# Altium schematic sheet CRAM_Mk1_connectors.SchDoc
size A4; SheetNumber: 2; SheetTotal: 2
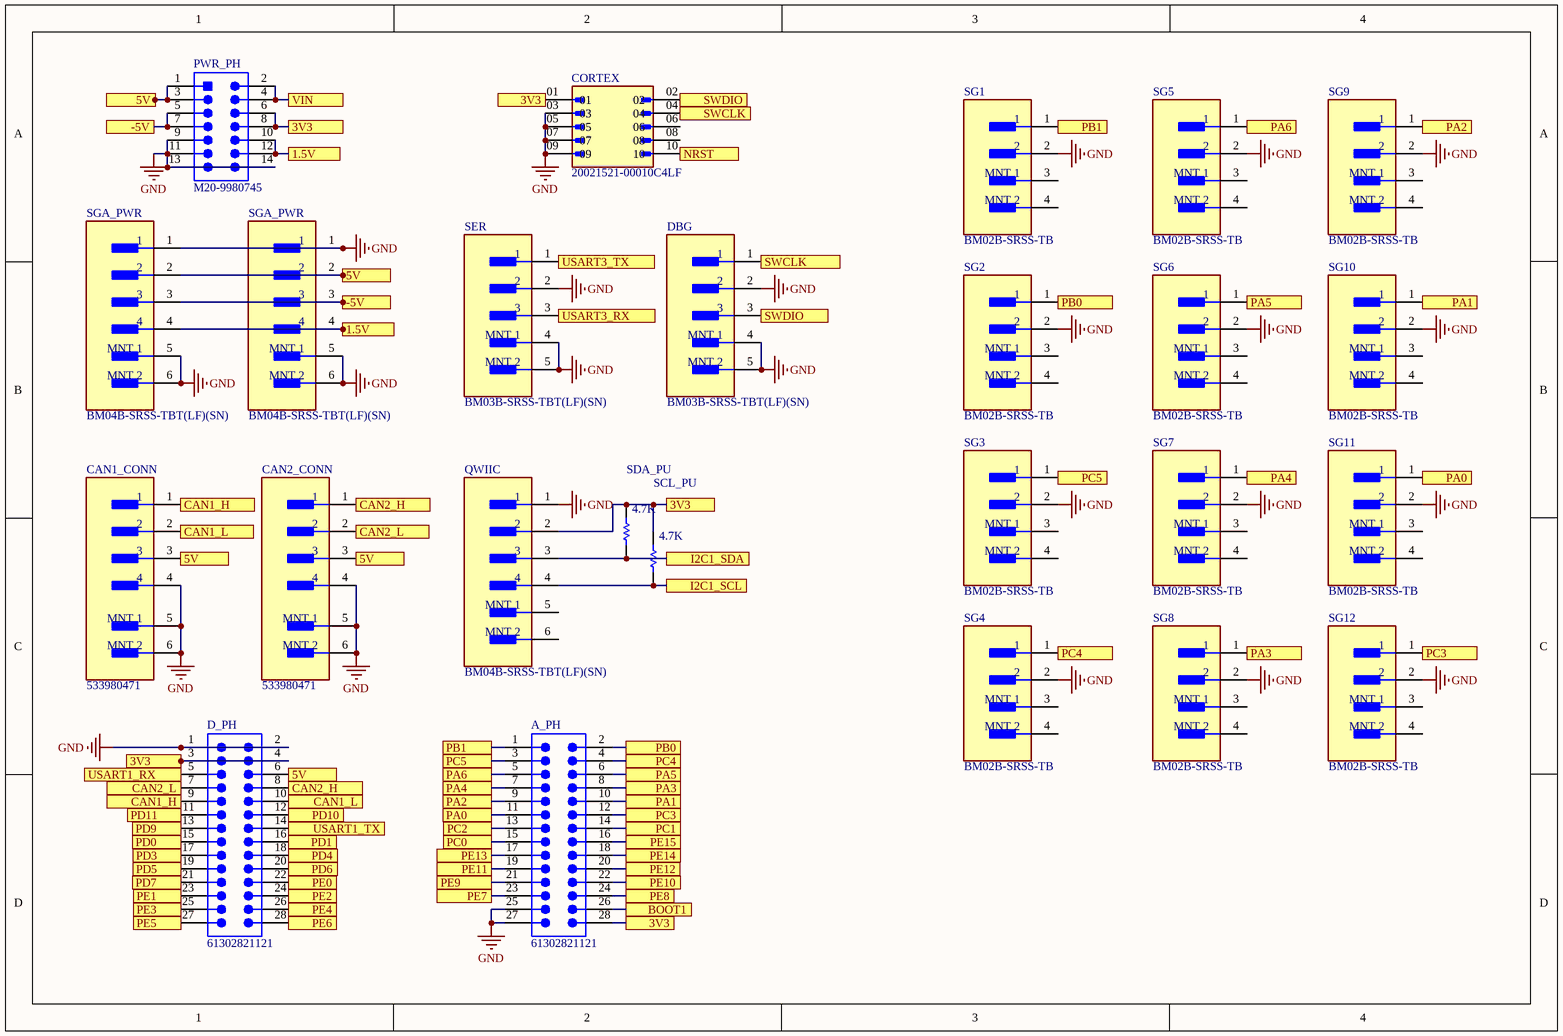
[diagram p0: CRAM_Mk1_connectors.SchDoc]

## Parts
(Parts that share a designator on the sheet are numbered #1, #2 ... from top to bottom, then left to right.)
A_PH  61302821121  [61302821121]
CAN1_CONN  533980471  [FP-533980471-MFG]
CAN2_CONN  533980471  [FP-533980471-MFG]
CORTEX  20021521-00010C4LF  [AMPHENOL_20021521-00010C4LF]
D_PH  61302821121  [61302821121]
DBG  BM03B-SRSS-TBT(LF)(SN)  [FP-BM03B-SRSS-TBT_LF_SN-MFG]
PWR_PH  M20-9980745  [HRWN-M20-9980745_V]
QWIIC  BM04B-SRSS-TBT(LF)(SN)  [FP-BM04B-SRSS-TBT_LF_SN-MFG]
SCL_PU  value 4.7K  [RESC1608X55X25ML10T15]  (hidden comment: Resistor 0R +/- 5% 0603 100 mW)
SDA_PU  value 4.7K  [RESC1608X55X25ML10T15]  (hidden comment: Resistor 0R +/- 5% 0603 100 mW)
SER  BM03B-SRSS-TBT(LF)(SN)  [FP-BM03B-SRSS-TBT_LF_SN-MFG]
SG1  BM02B-SRSS-TB  [FP-BM02B-SRSS-TB-MFG]
SG2  BM02B-SRSS-TB  [FP-BM02B-SRSS-TB-MFG]
SG3  BM02B-SRSS-TB  [FP-BM02B-SRSS-TB-MFG]
SG4  BM02B-SRSS-TB  [FP-BM02B-SRSS-TB-MFG]
SG5  BM02B-SRSS-TB  [FP-BM02B-SRSS-TB-MFG]
SG6  BM02B-SRSS-TB  [FP-BM02B-SRSS-TB-MFG]
SG7  BM02B-SRSS-TB  [FP-BM02B-SRSS-TB-MFG]
SG8  BM02B-SRSS-TB  [FP-BM02B-SRSS-TB-MFG]
SG9  BM02B-SRSS-TB  [FP-BM02B-SRSS-TB-MFG]
SG10  BM02B-SRSS-TB  [FP-BM02B-SRSS-TB-MFG]
SG11  BM02B-SRSS-TB  [FP-BM02B-SRSS-TB-MFG]
SG12  BM02B-SRSS-TB  [FP-BM02B-SRSS-TB-MFG]
SGA_PWR#1  BM04B-SRSS-TBT(LF)(SN)  [FP-BM04B-SRSS-TBT_LF_SN-MFG]
SGA_PWR#2  BM04B-SRSS-TBT(LF)(SN)  [FP-BM04B-SRSS-TBT_LF_SN-MFG]

## Ports
1.5V, 3V3, 5V, -5V, BOOT1, CAN1_H, CAN1_L, CAN2_H, CAN2_L, I2C1_SCL, I2C1_SDA, NRST, PA0, PA1, PA2, PA3, PA4, PA5, PA6, PB0, PB1, PC0, PC1, PC2, PC3, PC4, PC5, PD0, PD1, PD3, PD4, PD5, PD6, PD7, PD9, PD10, PD11, PE0, PE1, PE2, PE3, PE4, PE5, PE6, PE7, PE8, PE9, PE10, PE11, PE12, PE13, PE14, PE15, SWCLK, SWDIO, USART1_RX, USART1_TX, USART3_RX, USART3_TX, VIN

## Nets
GND: A_PH.25 A_PH.27 CAN1_CONN.4 CAN1_CONN.5(MNT_1) CAN1_CONN.6(MNT_2) CAN2_CONN.4 CAN2_CONN.5(MNT_1) CAN2_CONN.6(MNT_2) CORTEX.03 CORTEX.05 CORTEX.07 CORTEX.09 D_PH.1 D_PH.2 DBG.2 DBG.4(MNT_1) DBG.5(MNT_2) PWR_PH.9 PWR_PH.11 PWR_PH.13 PWR_PH.14 QWIIC.1 SER.2 SER.4(MNT_1) SER.5(MNT_2) SG1.2 SG2.2 SG3.2 SG4.2 SG5.2 SG6.2 SG7.2 SG8.2 SG9.2 SG10.2 SG11.2 SG12.2 SGA_PWR#1.1 SGA_PWR#1.5(MNT_1) SGA_PWR#1.6(MNT_2) SGA_PWR#2.1 SGA_PWR#2.5(MNT_1) SGA_PWR#2.6(MNT_2)
1.5V: PWR_PH.10 PWR_PH.12 SGA_PWR#1.4 SGA_PWR#2.4 ; port 1.5V
3V3: A_PH.28 CORTEX.01 D_PH.3 D_PH.4 PWR_PH.6 PWR_PH.8 QWIIC.2 SCL_PU.2 SDA_PU.2 ; port 3V3
5V: CAN1_CONN.3 CAN2_CONN.3 D_PH.6 PWR_PH.1 PWR_PH.3 SGA_PWR#1.2 SGA_PWR#2.2 ; port 5V
-5V: PWR_PH.5 PWR_PH.7 SGA_PWR#1.3 SGA_PWR#2.3 ; port -5V
BOOT1: A_PH.26 ; port BOOT1
CAN1_H: CAN1_CONN.1 D_PH.9 ; port CAN1_H
CAN1_L: CAN1_CONN.2 D_PH.10 ; port CAN1_L
CAN2_H: CAN2_CONN.1 D_PH.8 ; port CAN2_H
CAN2_L: CAN2_CONN.2 D_PH.7 ; port CAN2_L
I2C1_SCL: QWIIC.4 SCL_PU.1 ; port I2C1_SCL
I2C1_SDA: QWIIC.3 SDA_PU.1 ; port I2C1_SDA
NRST: CORTEX.10 ; port NRST
PA0: A_PH.11 SG11.1 ; port PA0
PA1: A_PH.10 SG10.1 ; port PA1
PA2: A_PH.9 SG9.1 ; port PA2
PA3: A_PH.8 SG8.1 ; port PA3
PA4: A_PH.7 SG7.1 ; port PA4
PA5: A_PH.6 SG6.1 ; port PA5
PA6: A_PH.5 SG5.1 ; port PA6
PB0: A_PH.2 SG2.1 ; port PB0
PB1: A_PH.1 SG1.1 ; port PB1
PC0: A_PH.15 ; port PC0
PC1: A_PH.14 ; port PC1
PC2: A_PH.13 ; port PC2
PC3: A_PH.12 SG12.1 ; port PC3
PC4: A_PH.4 SG4.1 ; port PC4
PC5: A_PH.3 SG3.1 ; port PC5
PD0: D_PH.15 ; port PD0
PD1: D_PH.16 ; port PD1
PD3: D_PH.17 ; port PD3
PD4: D_PH.18 ; port PD4
PD5: D_PH.19 ; port PD5
PD6: D_PH.20 ; port PD6
PD7: D_PH.21 ; port PD7
PD9: D_PH.13 ; port PD9
PD10: D_PH.12 ; port PD10
PD11: D_PH.11 ; port PD11
PE0: D_PH.22 ; port PE0
PE1: D_PH.23 ; port PE1
PE2: D_PH.24 ; port PE2
PE3: D_PH.25 ; port PE3
PE4: D_PH.26 ; port PE4
PE5: D_PH.27 ; port PE5
PE6: D_PH.28 ; port PE6
PE7: A_PH.23 ; port PE7
PE8: A_PH.24 ; port PE8
PE9: A_PH.21 ; port PE9
PE10: A_PH.22 ; port PE10
PE11: A_PH.19 ; port PE11
PE12: A_PH.20 ; port PE12
PE13: A_PH.17 ; port PE13
PE14: A_PH.18 ; port PE14
PE15: A_PH.16 ; port PE15
SWCLK: CORTEX.04 DBG.1 ; port SWCLK
SWDIO: CORTEX.02 DBG.3 ; port SWDIO
USART1_RX: D_PH.5 ; port USART1_RX
USART1_TX: D_PH.14 ; port USART1_TX
USART3_RX: SER.3 ; port USART3_RX
USART3_TX: SER.1 ; port USART3_TX
VIN: PWR_PH.2 PWR_PH.4 ; port VIN

Not connected (* = marked no-connect by the designer): CORTEX 06 08; QWIIC 5(MNT_1) 6(MNT_2); SG1 3(MNT_1) 4(MNT_2); SG2 3(MNT_1) 4(MNT_2); SG3 3(MNT_1) 4(MNT_2); SG4 3(MNT_1) 4(MNT_2); SG5 3(MNT_1) 4(MNT_2); SG6 3(MNT_1) 4(MNT_2); SG7 3(MNT_1) 4(MNT_2); SG8 3(MNT_1) 4(MNT_2); SG9 3(MNT_1) 4(MNT_2); SG10 3(MNT_1) 4(MNT_2); SG11 3(MNT_1) 4(MNT_2); SG12 3(MNT_1) 4(MNT_2)

## Library data of the parts
A_PH D_PH = CMP-1502-01115-2: NexarPartId: 32855566; Current Rating: 3A; Contact Resistance: 20mΩ; Pitch: 2.54mm; Connector Type: Male Pin; Number of Positions: 28; Gender: Male; Operating Supply Voltage: 250V; REACH SVHC: Unknown; Orientation: Vertical; Contact Material: Copper; Color: Black; Contact Plating: Gold; Contact Mating Length: 5.9944mm; Mount: Through Hole; Number of Rows: 2; Row Spacing: 2.54mm; Number of Contacts: 28; RoHS: Compliant; Packaging: Bulk; Number of Pins: 28; Lead Pitch: 2.54mm; Termination: Solder
CAN1_CONN CAN2_CONN = CMP-04776-000105-1: CONN HEADER SMD 4POS 1.25MM; Manufacturer: Molex; Conn Gender: Male; Conn Orientation: Vertical; Standoff Height: 0.05mm; Number Of Contacts: 4; Current Rating: 1A; Voltage Rating: 125V; Package: 0; ComponentLink2Description: Datasheet; ComponentLink2URL: https://www.molex.com/pdm_docs/ps/PS-51021-024-001.pdf; Ambient Temperature Range Low: -40°C; Category: Conn; Automotive: No; Number Of Rows: 1; Device Class L3: unset; Ambient Temperature Range High: +105°C; Height: 5.1mm; Lead Free: Yes; Pitch: 1.25mm; Contact Material: Tin; Footprint Url: https://www.molex.com/pdm_docs/sd/533980471_sd.pdf; Octopart: https://octopart.com/53398-0471-molex-655296; Temperature Range Low: -40°C; Device Class L2: Headers and Wire Housings; Temperature: -40°C to +105°C; Digikey Description: CONN HEADER SMD 4POS 1.25MM; RoHS: TRUE; Manufacturer Part Number: 533980471; Device Class L1: Connectors; Temperature Range High: +105°C
CORTEX = 20021521-00010C4LF: MF: {'manufacturer': u'Amphenol ICC (FCI)'}; Package: None; Price: None; Value: *; MP: 20021521-00010C4LF; Availability: Unavailable
DBG SER = CMP-17439-000244-1: CONN HEADER SMD 3POS 1MM; Voltage Rating: 50V; Pitch: 0.039inch; Number of Positions: 3; Mated Stacking Heights: 4.9mm; Flammability Rating: UL94 V-0; Termination: Solder; Color: Natural; Number of Rows: 1; Min Operating Temperature: -25°C; Connector Type: Header; Contact Finish - Mating: TIN; Contact Type: Male Pin; Packaging: Cut Tape; Mount: Surface Mount; Contact Material: Copper Alloy; Series: SR; Fastening Type: Pull; Insulation Material: Nylon; Max Operating Temperature: 85°C; Contact Plating: Tin; Insulation Color: Natural; Lead Free: Lead Free; Contact Shape: Square
PWR_PH = CMP-2000-06637-1: Male Header, Pitch 2.54 mm, 2 x 7 Position, Height 8.64 mm, Tail Length 3 mm, -40 to 105 degC, RoHS, Bag; Manufacturer: Harwin; No. of Rows: 2; No. of Contacts: 14; SVHC: NoSVHC(19-Dec-2012); Pitch Spacing: 2.54mm; Contact Termination: ThroughHoleVertical; Datasheet Version: 12/2006; Mounting Technology: ThroughHole; Package Reference: M20-9980745; Series: M20-9; Package Description: Male Header, Pitch 2.54 mm, 2 x 7 Position, Height 8.64 mm, Tail Length 3 mm; Package URL: https://cdn.harwin.com/pdfs/60page147.pdf; Manufacturer URL: https://www.harwin.com/; Datasheet URL: https://cdn.harwin.com/pdfs/M20-998.pdf; Gender: Header
QWIIC SGA_PWR#1 SGA_PWR#2 = CMP-17439-000370-1: CONN HEADER SMD 4POS 1MM; Voltage Rating: 50V; Number of Positions: 4; Pitch: 0.039inch; Mated Stacking Heights: 4.9mm; Packaging: Cut Tape; Contact Material: Copper Alloy; Lead Free: Lead Free; Contact Type: Male Pin; Fastening Type: Pull; Connector Type: Header; Contact Finish - Mating: TIN; Series: SR; Number of Rows: 1; Contact Shape: Square; Package Quantity: 1; Color: Natural; Flammability Rating: UL94 V-0; Mount: Surface Mount; Insulation Color: Natural; Termination: Solder; Contact Plating: Tin; Insulation Material: Nylon
SCL_PU SDA_PU = CMP-009-00006-5: Chip Resistor, 0 Ohm, 0.1 W, -55 to 155 degC, 0603 (1608 Metric); Voltage Rating: 50V; Power: 100mW; Max Operating Temperature: 155°C; RoHS Compliant: True; Tolerance: 5%; Pins: 2; Case/Package: 0603; Mounting Technology: SM; Min Operating Temperature: -55°C
SG1-SG12 = CMP-17439-000622-1: CONN HEADER SMD 2POS 1MM; Number of Contacts: 2; Connector Type: Male Pin; Pitch: 0.039inch; Termination: Solder; Housing Material: Nylon; Series: SR; Number of Positions: 2; Mount: Surface Mount; Color: Natural; Contact Type: Male Pin; Number of Rows: 1; Contact Material: Copper Alloy; Packaging: Cut Tape; Lead Free: Contains Lead; Orientation: Vertical; Housing Color: Natural; Package Quantity: 1; Contact Plating: Tin